# EasyEDA Pro project ProDoc_单路灰度对管3.0_2025-09-29.epro

# Schematic Schematic6_2
Board Name: 单路灰度对管3.0; Create Date: 2025-04-24; Page Name: P1; Project Name: 智能车竞赛2025; Schematic Name: Schematic6_2; Update Date: 2025-04-24; Company: 嘉立创EDA; Page Size: A4; Version: V1.0
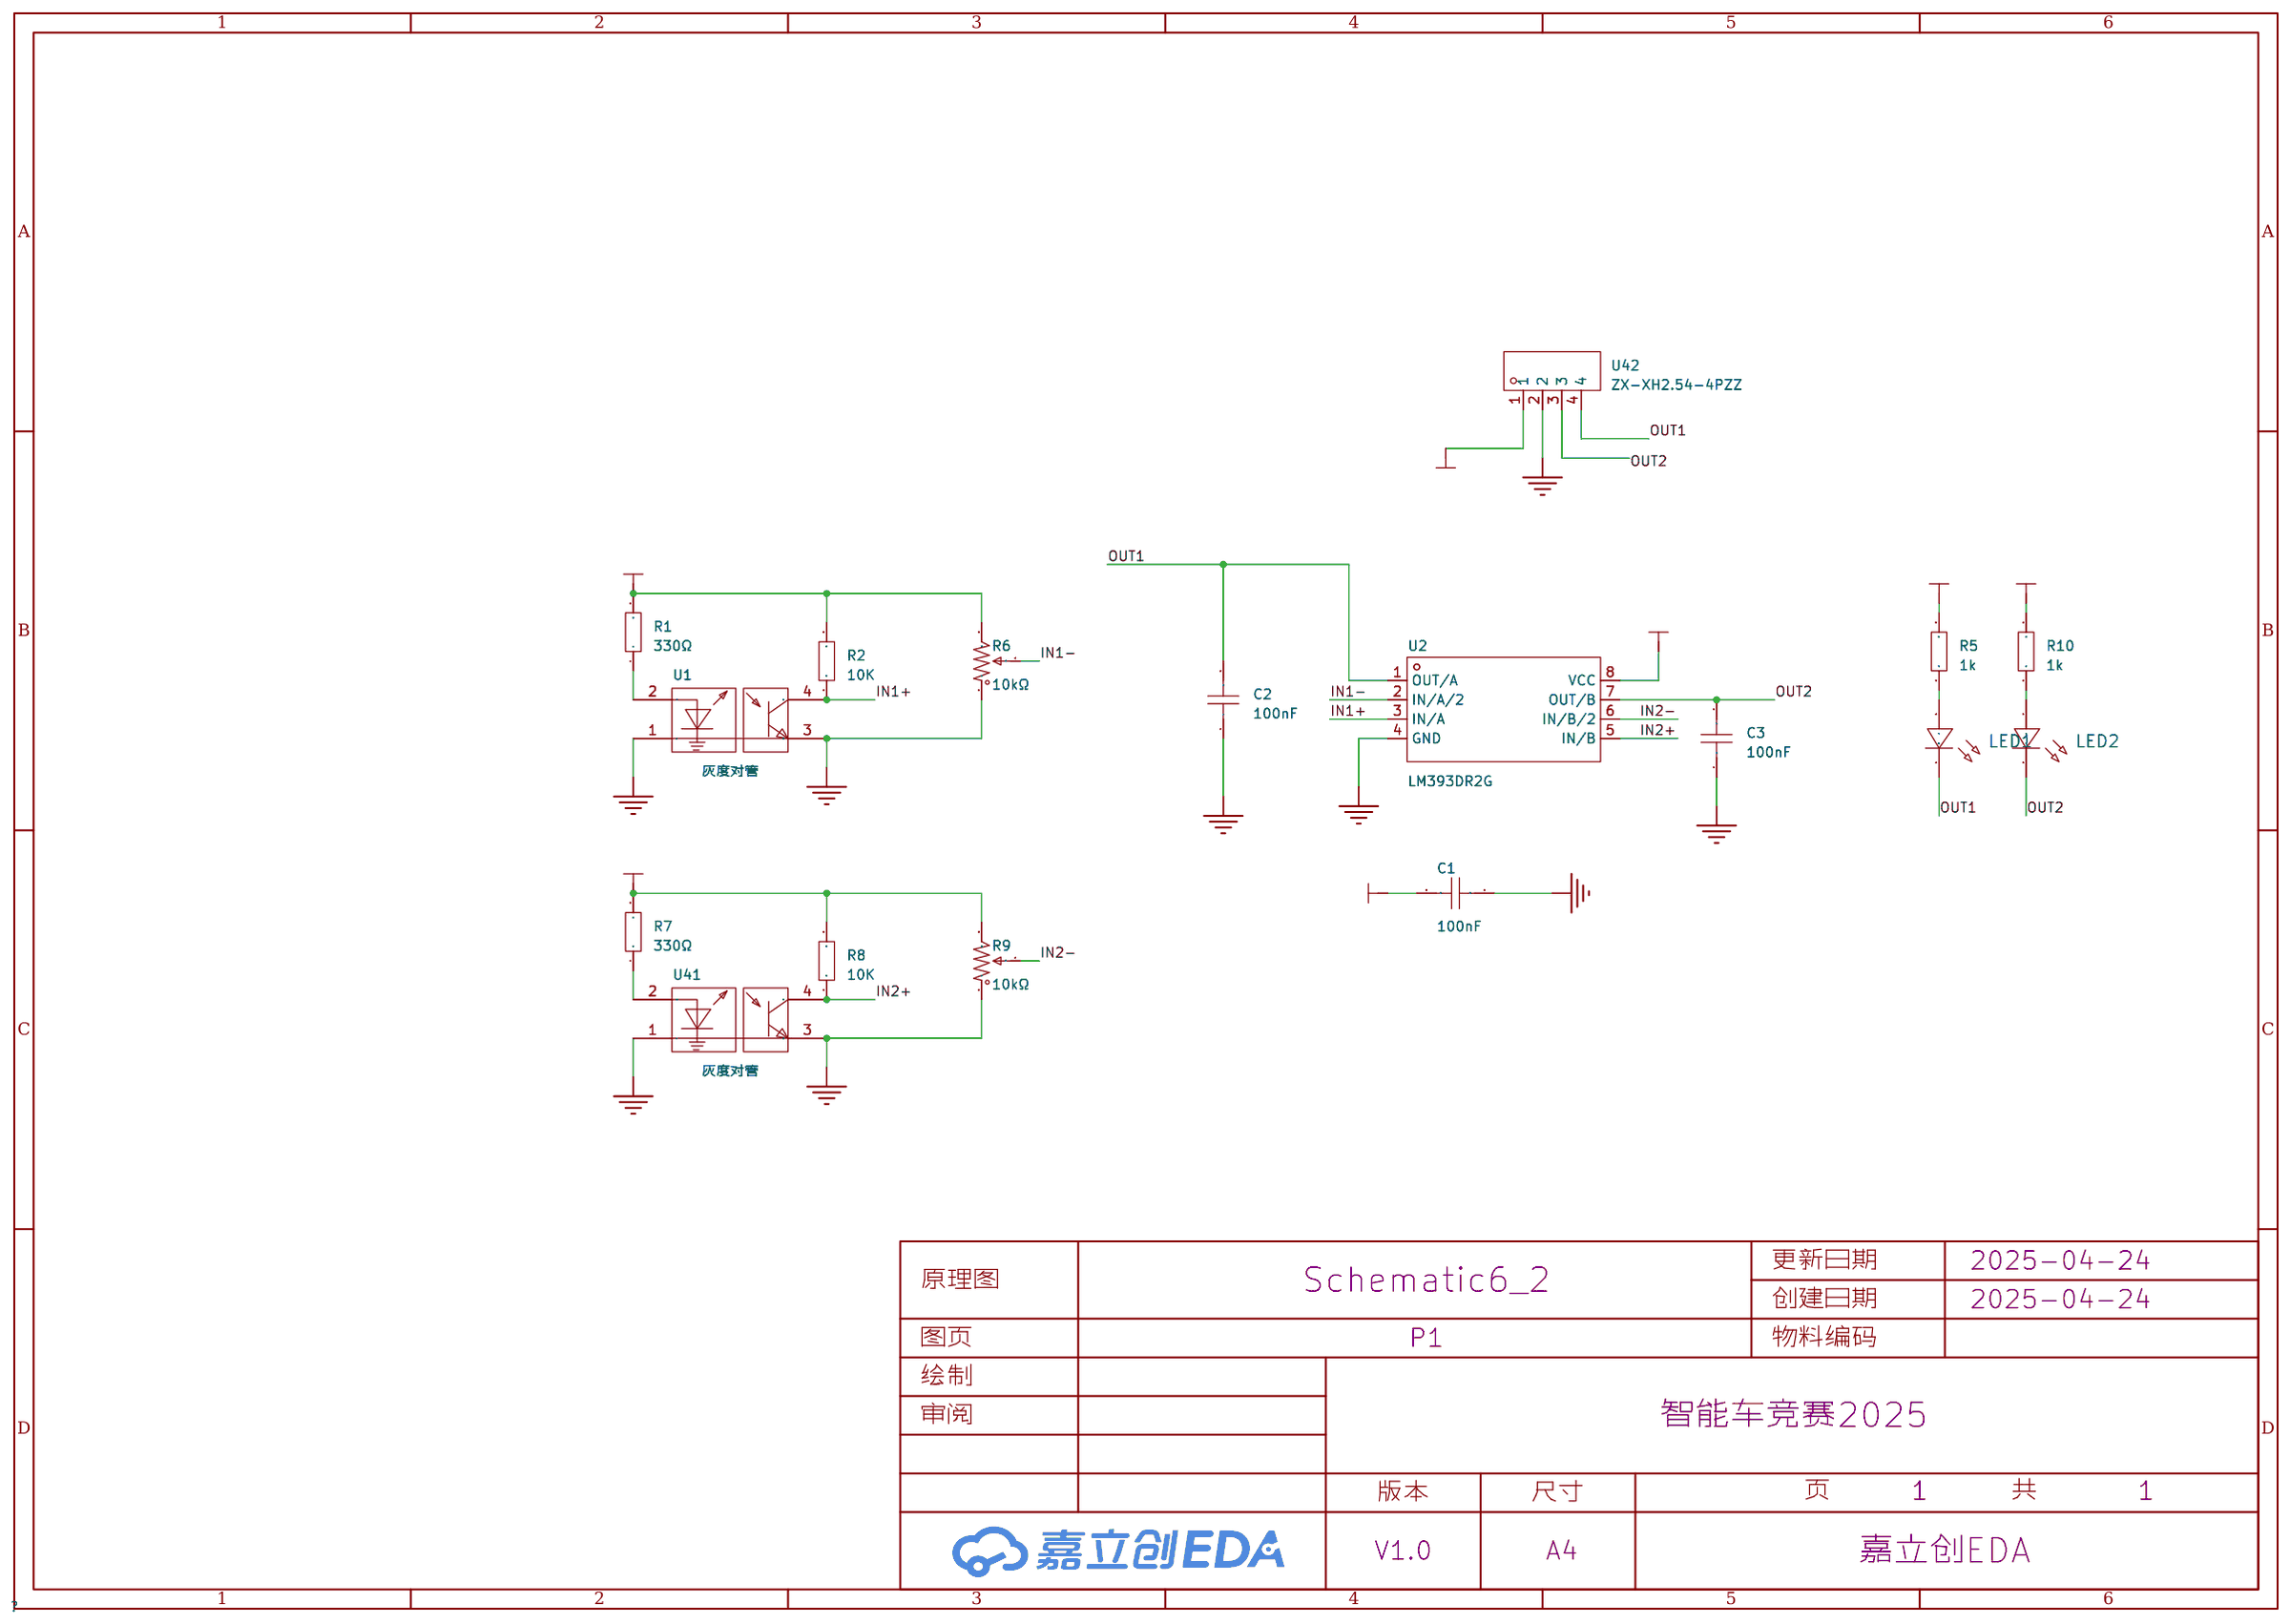
[diagram p0: schematic sheet]

## Parts
C1  100nF  [C0603]
C2  100nF  [C0603]
C3  100nF  [C0603]
LED1  -  [LED_0603]
LED2  -  [LED_0603]
R1  330Ω  [R0603]
R2  10K  [R0603]
R5  1k  [R0603]
R6  10kΩ  [RES-ADJ-TH_3362P]
R7  330Ω  [R0603]
R8  10K  [R0603]
R9  10kΩ  [RES-ADJ-TH_3362P]
R10  1k  [R0603]
U1  灰度对管  [OPTO-TH_ITR9909]
U2  LM393DR2G  [SOIC-8_L5.0-W4.0-P1.27-LS6.0-BL]
U41  灰度对管  [OPTO-TH_ITR9909]
U42  ZX-XH2.54-4PZZ  [CONN-TH_4P-P2.50_4PIN]

## Library data of the parts
C1-C3 = CAP_0603: Supplier Footprint: 0603
LED1 LED2 = LED_0603-R: Supplier Footprint: 0603
R1 R2 R5 R7 R8 R10 = Res_0603: Supplier Footprint: 0603
R6 R9 = 3362P-1-103: 阻值:10kΩ;精度:±10%;; LCSC Part Name: 10kΩ ±10%; Supplier Part: C118956; Manufacturer: BOCHEN(博晨); Supplier Footprint: 插件; JLCPCB Part Class: 扩展库; Datasheet: https://atta.szlcsc.com/upload/public/pdf/source/20171114/C118956_15106326650691117445.pdf; Supplier: LCSC; Tolerance: ±10%
U1 U41 = ITR9909: 感应距离:-;集电极电流(最大值):50mA;; Supplier Part: C53399; Manufacturer: EVERLIGHT(亿光); Supplier Footprint: DIP-4; JLCPCB Part Class: 扩展库; Datasheet: https://atta.szlcsc.com/upload/public/pdf/source/20201022/C53399_E5C79523D84B21DC4419F8E709CCCF2E.pdf; Supplier: LCSC; Collector Current (Max): 50mA
U2 = LM393DR2G: 输入失调电压(Vos):5mV;输入偏置电流(Ib):250nA;; LCSC Part Name: 比较器，双，低偏移电压; Supplier Part: C7955; Manufacturer: onsemi(安森美); Supplier Footprint: SOIC-8; JLCPCB Part Class: 基础库; Datasheet: https://atta.szlcsc.com/upload/public/pdf/source/20140815/1457707223499.pdf; Supplier: LCSC; Input Offset Voltage (Vos): 5mV; Input Bias Current (Ib): 250nA; Supply Voltage: 1V~18V；2V~36V; Output Type: 开集; Supply Current: 2.5mA; Operating Temperature: 0℃~+70℃
U42 = ZX-XH2.54-4PZZ: 插针结构:1x4P;间距:2.54mm;安装方式:直插;参考系列:XH;总PIN数:4P;排数:1;每排PIN数:4;行距:-;额定电流:3A;触头材质:黄铜;触头镀层:锡;工作温度范围:-25℃~+85℃;; Supplier Part: C7429634; Manufacturer: Megastar(兆星); Supplier Footprint: 插件,P=2.54mm; JLCPCB Part Class: 扩展库; Datasheet: https://atta.szlcsc.com/upload/public/pdf/source/20230619/B529A2163E0159A644AB3383D208FB03.pdf; Supplier: LCSC; Pins Structure: 1x4P; Pitch: 2.54mm; Mounting Style: 直插; Reference Series: XH; Number of Pins: 4P; Number of Rows: 1; Number of PINs Per Row: 4; Current Rating (Max): 3A; Contact Material: 黄铜; Contact Plating: 锡; Operating Temperature Range: -25℃~+85℃

## Nets
GND: C1.1 C2.1 C3.1 R6.1 R9.1 U1.1 U1.3 U2.4(GND) U41.1 U41.3 U42.2
VCC: C1.2 R1.2 R2.2 R5.2 R6.3 R7.2 R8.2 R9.3 R10.2 U2.8(VCC) U42.1
IN1+: R2.1 U1.4 U2.3(IN/A)
IN1-: R6.2 U2.2(IN/A/2)
IN2+: R8.1 U2.5(IN/B) U41.4
IN2-: R9.2 U2.6(IN/B/2)
OUT1: C2.2 LED1.1(C) U2.1(OUT/A) U42.4
OUT2: C3.2 LED2.1(C) U2.7(OUT/B) U42.3
$1N439: R1.1 U1.2
$1N445: LED1.2(A) R5.1
$1N2765: R7.1 U41.2
$1N2964: LED2.2(A) R10.1

# Board PCB20_2
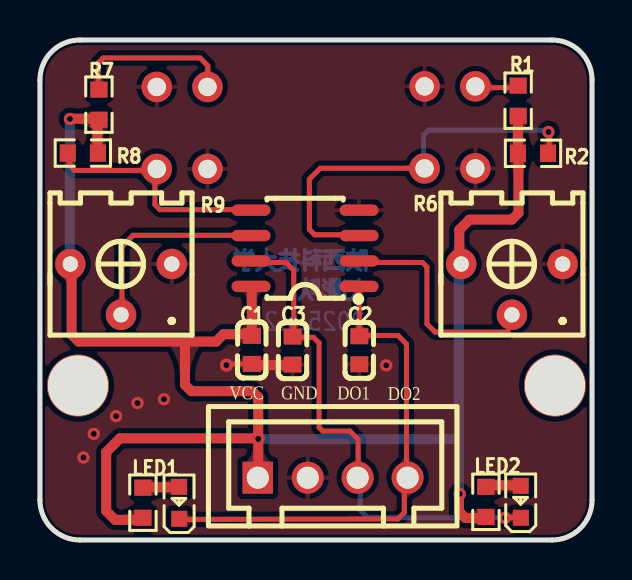
[diagram p1: board, top side]
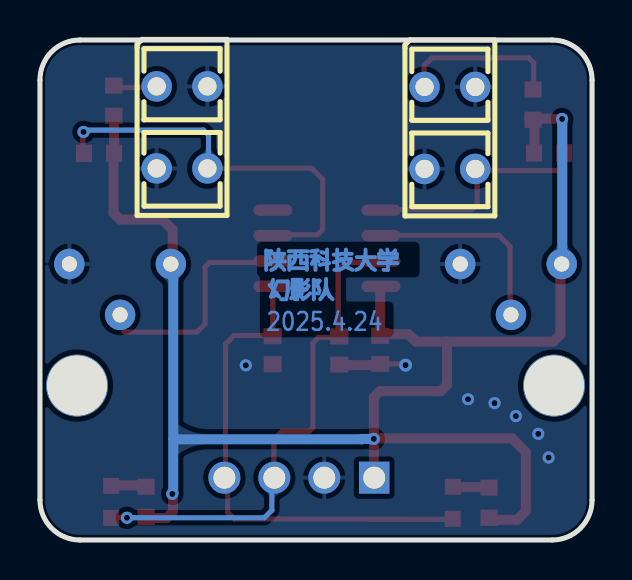
[diagram p2: board, bottom side, seen from below]

Outline 27.64 x 25 mm; copper layers: Top Layer, Bottom Layer. Coordinates in mm from the lower left corner of the outline.
Outline path: 0,23 0,2 arc(0.59,0.59) 2,0 25.64,0 arc(27.05,0.59) 27.64,2 27.64,23 arc(27.05,24.41) 25.64,25 2,25 arc(0.59,24.41) 0,23
Stack: Top Layer 0.035mm / Dielectric1 1.51mm FR4 er 4.5 / Bottom Layer 0.035mm

## Design rules (mm)
template: JLCPCB Capability(Two Layers Board)
spacing copperThickness1oz (default): track to track 0.102, other pairs 0.152 to 0.3
spacing copperThickness2oz: track to track 0.203, other pairs 0.152 to 0.3
track width copperThickness1oz (default): min 0.127, default 0.254, max 2.54
track width copperThickness2oz: min 0.203, default 0.254, max 2.54
differential pair differentialPair (default): width min 0.127, default 0.254, max 2.54; gap min 0.152, default 0.152
via viaSize (default): diameter min 0.5, default 0.61, max 10; hole min 0.3, default 0.305, max 6.3

## Placement (name value [footprint] x y rotation side)
C1  100nF  [C0603]  10.61 9.51 90 top
C2  100nF  [C0603]  15.99 9.49 90 top
C3  100nF  [C0603]  12.65 9.47 90 top
LED1  -  [LED_0603]  6.96 1.91 90 top
LED2  -  [LED_0603]  24.07 1.96 90 top
NOREF  -  [Pad_e220]  1.9 7.72 0 top
NOREF#2  -  [Pad_e218]  25.78 7.72 0 top
R1  330Ω  [R0603]  23.94 21.96 270 top
R2  10K  [R0603]  24.68 19.33 180 top
R5  1k  [R0603]  5.16 1.86 270 top
R6  10kΩ  [RES-ADJ-TH_3362P]  23.63 12.53 180 top
R7  330Ω  [R0603]  2.95 21.77 270 top
R8  10K  [R0603]  2.15 19.35 0 top
R9  10kΩ  [RES-ADJ-TH_3362P]  4.06 12.53 180 top
R10  1k  [R0603]  22.33 1.91 270 top
U1  灰度对管  [OPTO-TH_ITR9909]  20.53 20.63 270 bottom
U2  LM393DR2G  [SOIC-8_L5.0-W4.0-P1.27-LS6.0-BL]  13.27 14.59 90 top
U41  灰度对管  [OPTO-TH_ITR9909]  7.12 20.6 270 bottom
U42  ZX-XH2.54-4PZZ  [CONN-TH_4P-P2.50_4PIN]  14.66 3.11 0 top

## Footprints (pads in the part's own frame, mm; a bottom-side part is the same pattern mirrored in y, then rotated)
C0603
  rect 0.8x0.9 smd: 1(-0.7,0) 2(0.7,0)
CONN-TH_4P-P2.50_4PIN
  rect 1.524x1.6 hole 1.1: 1(-3.75,0)
  round 1.6 hole 1.1: 2(-1.25,0) 3(1.25,0) 4(3.75,0)
LED_0603
  rect 0.8x0.8 smd: 1(-0.851,-0.01) 2(0.75,-0.005)
OPTO-TH_ITR9909
  round 1.524 hole 0.914: 1(-2.05,1.27) 2(-2.05,-1.27) 3(2.05,-1.27) 4(2.05,1.27)
Pad_e218
  round 3.1 hole 3: 1(0,0)
Pad_e220
  round 3.1 hole 3: 1(0,0)
R0603
  rect 0.806x0.864 smd: 1(-0.753,0) 2(0.753,0)
RES-ADJ-TH_3362P
  round 1.524 hole 0.762: 1(-2.54,-1.27) 2(0,1.27) 3(2.54,-1.27)
SOIC-8_L5.0-W4.0-P1.27-LS6.0-BL
  oval 0.569x1.95 smd: 1(-1.905,-2.705) 2(-0.635,-2.705) 3(0.635,-2.705) 4(1.905,-2.705) 5(1.905,2.705) 6(0.635,2.705) 7(-0.635,2.705) 8(-1.905,2.705)

## Nets
As in the schematic.

Pads without a net: NOREF 1; NOREF#2 1

## Via types
v1: diameter 0.61, hole 0.305, Top Layer to Bottom Layer, 11 vias
v2: diameter 0.65, hole 0.305, Top Layer to Bottom Layer, 1 via

## Routing (per net, layer and track width the routed paths; a pad name or vN(x,y) marks a point on that pad's centre or on a via; arc(x,y) is an arc through that point)
GND: length 3.4
  Top Layer w0.254: v2(9.34,8.74) 9.4,8.81 C1.1
  Top Layer w0.5: C1.1 10.67,8.74 12.58,8.74 12.64,8.81
  vias: v1(2.17,4.12) v1(2.69,5.31) v1(3.81,6.19) v1(4.88,6.85) v1(6.21,7.04) v1(17.34,8.73)
VCC: length 83.6
  Top Layer w0.5: 2.9,19.45 2.88,19.47 2.88,21 ; 10.93,5.08 4.01,5.08 3.32,4.39 3.32,1.45 3.76,1.01 5.16,1.01 ; 10.93,5.08 11.01,5.08 ; 10.93,5.08 10.93,7.14 10.62,7.44 7.59,7.44 ; 7.26,9.92 1.94,9.92 1.59,10.27 1.59,13.34 1.31,13.61 ; 7.26,9.92 8.82,9.92 9.19,10.29 10.56,10.29 ; 7.26,9.92 7.26,7.76 7.58,7.44 ; v1(1.5,21.05) 1.51,21.06 3.14,21.06 ; 22.46,1.1 21.3,1.1 20.98,1.42 20.98,2.27 v1(21.01,2.31) ; 23.95,19.18 23.95,16.35 23.62,16.02 21.5,16.02 21,15.51 21,13.51 21.15,13.35 ; 23.93,19.29 23.93,21.05 24.02,21.14 ; C1.2 10.61,12.64 U2.8 ; 10.67,3.21 10.93,3.47 v1(10.93,5.05)
  Bottom Layer w0.5: 20.97,2.38 21.01,2.33 v1(21.01,2.31) ; 20.97,2.38 20.97,2.38 ; 20.97,2.38 20.97,13.82 20.87,13.92 ; v1(1.5,21.05) 1.49,21.04 1.49,13.57 1.32,13.41 ; 20.95,5.04 11.51,5.04 11.5,5.05 v1(10.93,5.05)
IN1+: length 20
  Top Layer w0.254: 25.46,19.32 25.5,19.36 25.5,20.39 ; 19.34,18.59 14.03,18.59 13.49,18.04 13.49,15.52 13.75,15.26 15.64,15.26
  Bottom Layer w0.254: 19.2,18.5 19.2,20.24 19.46,20.5 25.44,20.5
  vias: v1(25.46,20.4)
IN1-: length 10.3
  Top Layer w0.254: 16.25,13.88 19.15,13.88 19.37,13.65 19.37,10.8 19.78,10.39 23.4,10.39 23.43,10.43
IN2+: length 10.7
  Top Layer w0.254: 5.68,18.37 5.58,18.47 1.74,18.47 1.49,18.73 1.49,19.17 ; 10.27,16.52 6.01,16.52 5.75,16.77 5.75,18.1
IN2-: length 10.4
  Top Layer w0.254: 10.19,15.23 4.66,15.23 4.11,14.68 4.11,10.64
OUT1: length 24.5
  Top Layer w0.254: 18.35,3.28 18.35,9.8 17.92,10.23 15.99,10.23 15.99,12.48 15.93,12.53 ; 6.9,1.06 6.93,1.03 17.92,1.05 18.24,1.38 18.24,2.95
OUT2: length 24.2
  Top Layer w0.254: 15.93,3.52 15.93,5.03 15.51,5.45 14.15,5.45 13.97,5.63 13.97,9.85 13.69,10.13 12.71,10.13 ; 12.71,10.13 12.71,13.48 12.32,13.88 10.94,13.88 ; 12.71,10.13 12.71,10 ; 24.11,1.13 23.34,1.13 23.33,1.12
  Bottom Layer w0.254: v1(23.28,1.11) 23.28,1.11 16.4,1.11 16.03,1.48 16.03,2.81
$1N439: length 2
  Top Layer w0.254: 22.09,22.62 24.04,22.62
$1N445: length 1.7
  Top Layer w0.5: 7.07,2.58 7.01,2.64 5.41,2.64
$1N2765: length 8
  Top Layer w0.254: 2.94,23.88 3.17,24.1 8.01,24.1 8.4,23.71 8.4,22.85 8.3,22.75 ; 2.92,23.88 2.92,22.77 3.03,22.66
$1N2964: length 1.7
  Top Layer w0.5: 24.09,2.62 23.98,2.73 22.47,2.73

## Copper pours and planes (outline as drawn; the poured copper is in the pictures)
GND on Top Layer: -1.83,26.19 28.53,26.19 28.53,-0.84 -1.83,-0.84
GND on Bottom Layer: -1.58,26 29.34,26 29.34,-0.46 -1.58,-0.46

Small or netless copper shapes (teardrops, artwork), in the pictures only: 55 on Top Layer, 10 on Bottom Layer

## Text on the board
Bottom Layer: 2025.4.24 | 幻影队 | 陕西科技大学
Bottom Solder Mask Layer: 2025.4.24 | 幻影队 | 陕西科技大学
Top Silkscreen Layer: VCC | GND | DO1 | DO2
